# EAGLE design Board v1 (EAGLE 9.1.0)
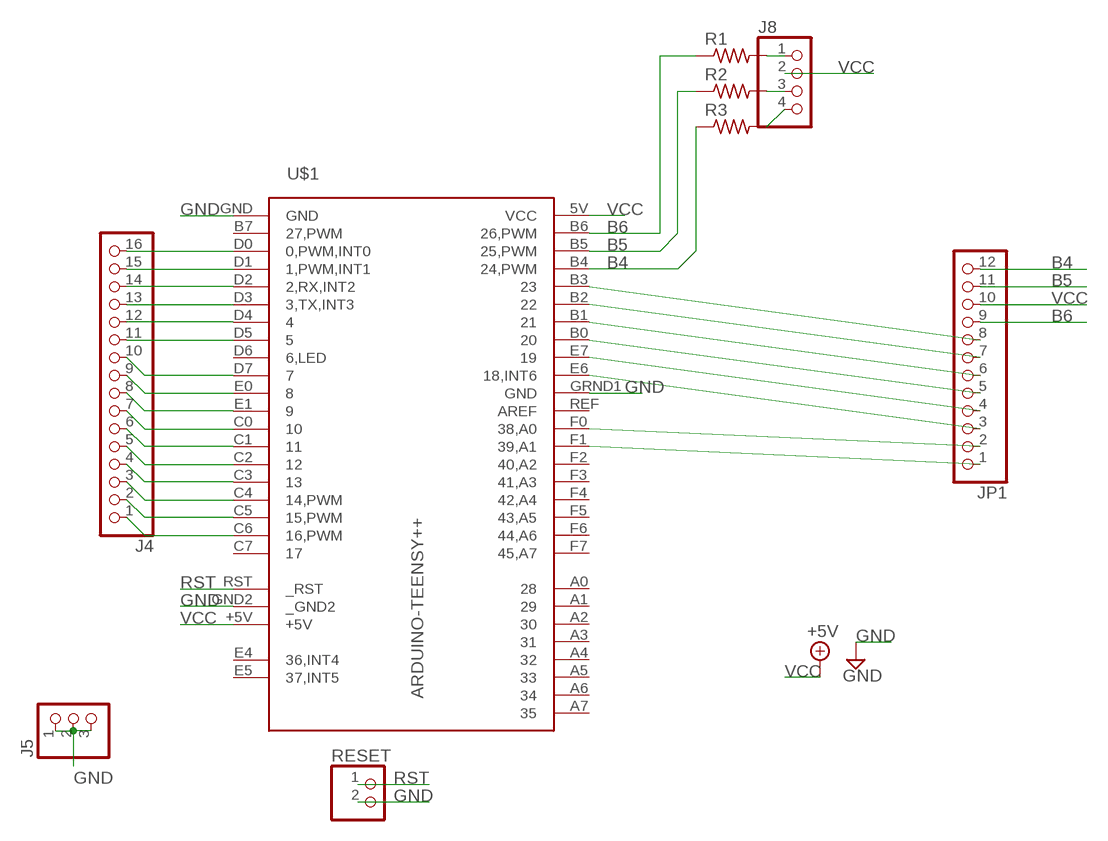
[diagram p0: schematic, sheet 1]

## Parts
J4  PINHD-1X16  [1X16]
J5  PINHD-1X3  [1X03]
J8  PINHD-1X4  [1X04]
JP1  PINHD-1X12  [1X12]
R1  R-US_R0805  [R0805]
R2  R-US_R0805  [R0805]
R3  R-US_R0805  [R0805]
RESET  PINHD-1X2  [1X02]
U$1  ARDUINO-TEENSY++  [TEENSY++]

## Nets
B4: JP1.12 R3.1 U$1.B4(24,PWM)
B5: JP1.11 R2.1 U$1.B5(25,PWM)
B6: JP1.9 R1.1 U$1.B6(26,PWM)
GND: J5.1 J5.2 J5.3 RESET.2 U$1.GND U$1.GND2(_GND2) U$1.GRND1(GND)
N$1: J4.16 U$1.D0(0,PWM,INT0)
N$2: J8.1 R1.2
N$3: J8.3 R2.2
N$4: J8.4 R3.2
N$5: J4.15 U$1.D1(1,PWM,INT1)
N$6: J4.14 U$1.D2(2,RX,INT2)
N$7: J4.13 U$1.D3(3,TX,INT3)
N$8: J4.12 U$1.D4
N$9: J4.11 U$1.D5
N$10: J4.10 U$1.D7
N$11: J4.9 U$1.E0
N$12: J4.8 U$1.E1
N$13: J4.7 U$1.C0
N$14: J4.6 U$1.C1
N$15: J4.5 U$1.C2
N$16: J4.4 U$1.C3
N$17: J4.3 U$1.C4(14,PWM)
N$18: J4.2 U$1.C5(15,PWM)
N$19: J4.1 U$1.C6(16,PWM)
N$23: JP1.8 U$1.B3
N$24: JP1.7 U$1.B2
N$25: JP1.6 U$1.B1
N$26: JP1.5 U$1.B0
N$27: JP1.4 U$1.E7
N$28: JP1.3 U$1.E6(18,INT6)
N$29: JP1.2 U$1.F0(38,A0)
N$30: JP1.1 U$1.F1(39,A1)
RST: RESET.1 U$1.RST(_RST)
VCC: J8.2 JP1.10 U$1.5V(VCC) U$1.+5V ; supply symbol labelled +5V
Unconnected: U$1.A0 U$1.A1 U$1.A2 U$1.A3 U$1.A4 U$1.A5 U$1.A6 U$1.A7 U$1.B7(27,PWM) U$1.C7 U$1.D6(6,LED) U$1.E4(36,INT4) U$1.E5(37,INT5) U$1.F2(40,A2) U$1.F3(41,A3) U$1.F4(42,A4) U$1.F5(43,A5) U$1.F6(44,A6) U$1.F7(45,A7) U$1.REF(AREF)

## Library data of the parts
J4 = pinhead:PINHD-1X16: PIN HEADER
J5 = pinhead:PINHD-1X3: PIN HEADER
J8 = pinhead:PINHD-1X4: PIN HEADER
JP1 = pinhead:PINHD-1X12: PIN HEADER
R1-R3 = resistor:R-US_: RESISTOR, American symbol
RESET = pinhead:PINHD-1X2: PIN HEADER
U$1 = teensypp:ARDUINO-TEENSY++

## Board
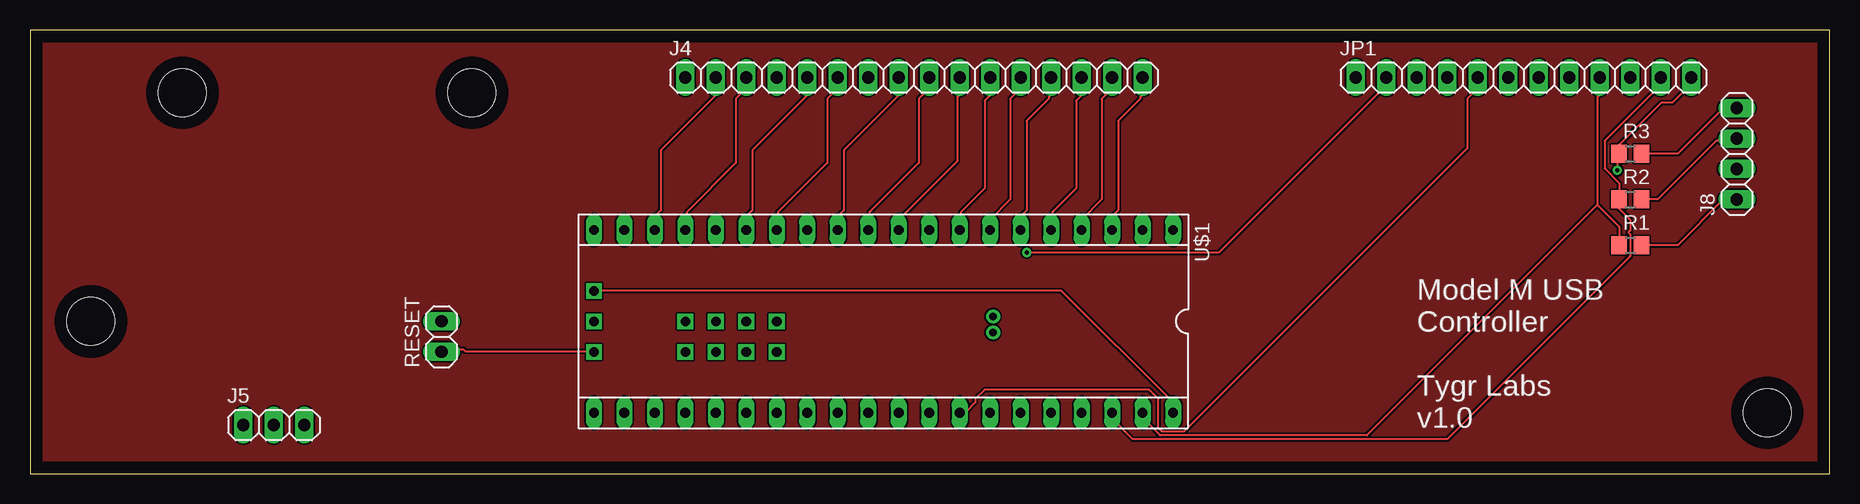
[diagram p1: board, top side]
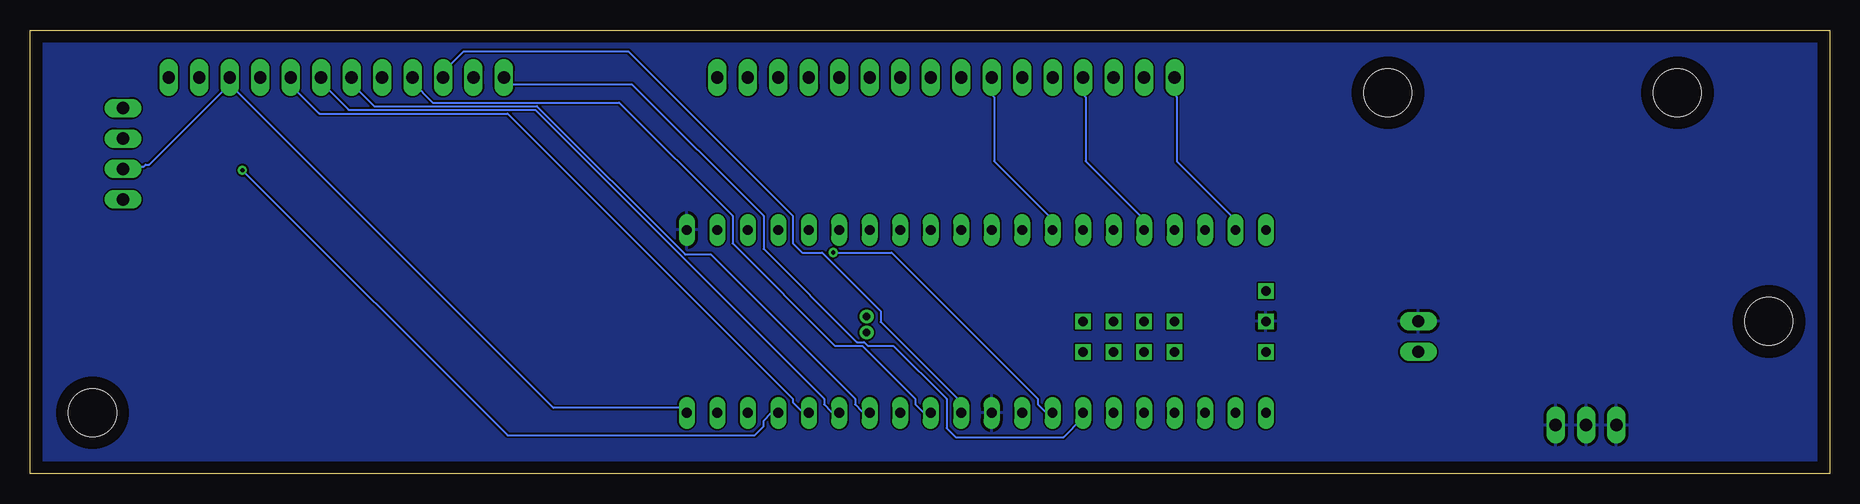
[diagram p2: board, bottom side, seen from below]

Size 149.99 x 36.98 mm. Coordinates in mm from the lower left corner, seen from the top.
Outline: 0,0 149.99,0 149.99,36.98 0,36.98 0,0
Copper layers (1*16): Top 0.035mm / dielectric 1.5mm / Bottom 0.035mm
Design rules "default": minimum track width 6mil, minimum drill 0.35mm, track to track 6mil, track to pad 6mil, pad to pad 6mil, via to via 6mil, smd to smd 6mil, copper to edge 40mil, drill to drill 6mil, minimum pad ring 10mil, minimum via ring 8mil, stop-mask expansion 4mil, vias tented up to drill 0mil, thermal gap 10mil
Holes 3.99 mm at 5.08,12.7 12.7,31.75 36.83,31.75 144.78,5.08

### Footprints (pad centres in the part's own frame; a part is rotated, then mirrored left to right if it is on the bottom)
1X16 = drill 1.016 long: 1 -19.05,0; 2 -16.51,0; 3 -13.97,0; 4 -11.43,0; 5 -8.89,0; 6 -6.35,0; 7 -3.81,0; 8 -1.27,0; 9 1.27,0; 10 3.81,0; 11 6.35,0; 12 8.89,0; 13 11.43,0; 14 13.97,0; 15 16.51,0; 16 19.05,0
1X03 = drill 1.016 long: 1 -2.54,0; 2 0,0; 3 2.54,0
1X04 = drill 1.016 long: 1 -3.81,0; 2 -1.27,0; 3 1.27,0; 4 3.81,0
1X12 = drill 1.016 long: 1 -13.97,0; 2 -11.43,0; 3 -8.89,0; 4 -6.35,0; 5 -3.81,0; 6 -1.27,0; 7 1.27,0; 8 3.81,0; 9 6.35,0; 10 8.89,0; 11 11.43,0; 12 13.97,0
R0805 = smd 1.3 x 1.5: 1 -0.95,0; 2 0.95,0
1X02 = drill 1.016 long: 1 -1.27,0; 2 1.27,0
TEENSY++ = drill 0.8 square: 5V 24.13,-2.54; A0 8.89,0; A1 11.43,0; A2 13.97,0; A3 16.51,0; A4 8.89,2.54; A5 11.43,2.54; A6 13.97,2.54; A7 16.51,2.54; GND2 24.13,0; RST 24.13,2.54 | drill 0.813 long: +5V -24.13,7.62; B0 -6.35,7.62; B1 -8.89,7.62; B2 -11.43,7.62; B3 -13.97,7.62; B4 -16.51,7.62; B5 -19.05,7.62; B6 -21.59,7.62; B7 -21.59,-7.62; C0 6.35,-7.62; C1 8.89,-7.62; C2 11.43,-7.62; C3 13.97,-7.62; C4 16.51,-7.62; C5 19.05,-7.62; C6 21.59,-7.62; C7 24.13,-7.62; D0 -19.05,-7.62; D1 -16.51,-7.62; D2 -13.97,-7.62; D3 -11.43,-7.62; D4 -8.89,-7.62; D5 -6.35,-7.62; D6 -3.81,-7.62; D7 -1.27,-7.62; E0 1.27,-7.62; E1 3.81,-7.62; E6 -1.27,7.62; E7 -3.81,7.62; F0 6.35,7.62; F1 8.89,7.62; F2 11.43,7.62; F3 13.97,7.62; F4 16.51,7.62; F5 19.05,7.62; F6 21.59,7.62; F7 24.13,7.62; GND -24.13,-7.62; GRND1 1.27,7.62; REF 3.81,7.62 | drill 0.635 pad 1.067: E4 -9.144,0.914; E5 -9.144,-0.406

### Placement (x,y rotation side)
J4  73.66,33.02 0 top
J5  20.32,4.06 0 top
J8  142.24,26.67 90 top
JP1  124.46,33.02 0 top
R1  133.35,19.05 0 top
R2  133.35,22.86 0 top
R3  133.35,26.67 0 top
RESET  34.29,11.43 90 top
U$1  71.12,12.7 180 top

### Tracks (layer width: path | path; a pad name or v marks a point on that pad's centre or on a via)
B4  (via drill 0.35)
  Top 0.152: JP1.12 138.38,32.92 138.38,32.46 136.85,30.94 135.94,30.94 132.44,27.43 132.44,26.67 R3.1 132.28,26.67 v132.28,25.3
  Bottom 0.152: v132.28,25.3 110.19,3.2 89.61,3.2 88.85,3.96 88.85,4.42 88.24,5.03 87.63,5.03 U$1.B4
B5
  Top 0.152: 132.44,22.86 132.44,24.23 131.22,25.45 131.22,27.74 135.79,32.31 135.79,32.92 JP1.11 | 132.44,22.86 R2.1 132.44,22.86 | 132.44,22.86 132.44,22.1 133.35,21.18 133.35,20.27 133.2,20.12 133.35,19.96 133.35,18.14 118.11,2.9 91.9,2.9 90.22,4.57 90.22,5.03 U$1.B5
B6
  Top 0.152: 130.61,22.4 132.44,20.57 132.44,19.05 R1.1 | 130.61,22.4 130.61,31.39 130.76,31.55 130.76,32.92 JP1.9 | 130.61,22.4 111.4,3.2 94.18,3.2 92.81,4.57 92.81,5.03 U$1.B6
GND
  pour Bottom: 0,0 0,36.83 149.86,36.83 149.86,0
N$1
  Top 0.152: U$1.D0 90.22,20.42 90.22,21.49 90.68,21.95 90.68,29.41 92.51,31.24 92.51,31.39 92.66,31.55 92.66,32.92 J4.16
N$2
  Top 0.152: R1.2 134.42,19.05 137.31,19.05 141.12,22.86 142.19,22.86 J8.1
N$3
  Top 0.152: R2.2 134.42,22.86 135.64,22.86 140.51,27.74 140.66,27.74 140.82,27.89 142.19,27.89 J8.3
N$4
  Top 0.152: R3.2 134.42,26.67 137.31,26.67 141.12,30.48 142.19,30.48 J8.4
N$5
  Top 0.152: U$1.D1 87.63,20.42 87.63,21.18 89.31,22.86 89.31,31.24 90.07,32 90.07,32.92 J4.15
N$6
  Top 0.152: U$1.D2 85.19,20.42 85.19,21.79 87.17,23.77 87.17,31.09 87.63,31.55 87.63,32.92 J4.14
N$7
  Top 0.152: U$1.D3 82.6,20.42 82.6,21.49 83.06,21.95 83.06,29.41 84.89,31.24 84.89,31.39 85.04,31.55 85.04,32.92 J4.13
N$8
  Top 0.152: U$1.D4 80.01,20.42 80.01,21.18 81.69,22.86 81.69,31.24 82.45,32 82.45,32.92 J4.12
N$9
  Top 0.152: U$1.D5 77.57,20.42 77.57,21.79 79.55,23.77 79.55,31.09 80.01,31.55 80.01,32.92 J4.11
N$10
  Top 0.152: U$1.D7 72.39,20.42 72.39,21.18 77.27,26.06 77.27,31.39 77.42,31.55 77.42,32.92 J4.10
N$11
  Top 0.152: U$1.E0 69.95,20.42 69.95,21.79 74.07,25.91 74.07,31.24 74.83,32 74.83,32.92 J4.9
N$12
  Top 0.152: U$1.E1 67.36,20.42 67.36,21.49 67.82,21.95 67.82,26.98 72.39,31.55 72.39,32.92 J4.8
N$13
  Bottom 0.152: U$1.C0 64.77,20.42 64.77,21.18 69.65,26.06 69.65,31.39 69.8,31.55 69.8,32.92 J4.7
N$14
  Top 0.152: U$1.C1 62.33,20.42 62.33,21.79 66.45,25.91 66.45,31.24 67.21,32 67.21,32.92 J4.6
N$15
  Top 0.152: U$1.C2 59.74,20.42 59.74,21.49 60.2,21.95 60.2,26.98 64.77,31.55 64.77,32.92 J4.5
N$16
  Bottom 0.152: U$1.C3 57.15,20.42 57.15,21.18 62.03,26.06 62.03,31.39 62.18,31.55 62.18,32.92 J4.4
N$17
  Top 0.152: U$1.C4 54.71,20.42 54.71,21.79 58.83,25.91 58.83,31.24 59.59,32 59.59,32.92 J4.3
N$18
  Top 0.152: U$1.C5 52.12,20.42 52.12,21.49 52.58,21.95 52.58,26.98 57.15,31.55 57.15,32.92 J4.2
N$19
  Bottom 0.152: U$1.C6 49.53,20.42 49.53,21.18 54.41,26.06 54.41,31.39 54.56,31.55 54.56,32.92 J4.1
N$23
  Bottom 0.152: U$1.B3 85.19,5.18 85.65,5.18 86.41,5.94 86.41,6.25 110.19,30.02 125.88,30.02 128.17,32.31 128.17,32.92 JP1.8
N$24
  Bottom 0.152: U$1.B2 82.6,5.18 83.21,5.18 83.82,5.79 83.82,6.25 107.9,30.33 123.44,30.33 125.73,32.61 125.73,32.92 JP1.7
N$25
  Bottom 0.152: U$1.B1 80.01,5.18 80.62,5.18 81.23,5.79 81.23,6.25 93.27,18.29 95.4,18.29 107.75,30.63 121.31,30.63 123.14,32.46 123.14,32.92 JP1.6
N$26
  Top 0.152: U$1.B0 77.57,5.18 78.03,5.18 78.79,5.94 78.79,6.25 79.55,7.01 93.27,7.01 94.03,6.25 94.03,3.81 94.34,3.5 96.16,3.5 119.79,27.13 119.79,31.24 120.55,32 120.55,32.92 JP1.5
N$27
  Bottom 0.152: U$1.E7 74.98,5.18 75.59,5.18 76.2,5.79 76.2,6.25 80.62,10.67 82.91,10.67 91.44,19.2 91.44,21.49 100.89,30.94 116.43,30.94 118.11,32.61 118.11,32.92 JP1.4
N$28
  Bottom 0.152: U$1.E6 72.39,5.18 72.39,5.94 79.1,12.65 79.1,13.56 83.97,18.44 85.65,18.44 86.41,19.2 86.41,21.49 100.13,35.2 113.84,35.2 115.52,33.53 115.52,33.07 JP1.3
N$29  (via drill 0.35)
  Top 0.152: v83.06,18.44 99.06,18.44 112.93,32.31 112.93,32.92 JP1.2
  Bottom 0.152: v83.06,18.44 78.18,18.44 65.99,6.25 65.99,5.79 65.38,5.18 64.77,5.18 U$1.F0
N$30
  Bottom 0.152: U$1.F1 62.33,5.03 62.33,4.57 63.86,3.05 72.85,3.05 73.61,3.81 73.61,6.25 78.03,10.67 80.16,10.67 80.47,10.97 81.08,10.97 88.85,18.75 88.85,21.49 99.82,32.46 110.03,32.46 110.49,32.92 JP1.1
N$32
  pour Top: 0,0 0,36.83 149.86,36.83 149.86,0
RST
  Top 0.152: U$1.RST 46.94,10.21 36.27,10.21 36.12,10.36 34.44,10.36 34.29,10.21 RESET.1
VCC
  Top 0.152: U$1.5V 47.09,15.24 85.95,15.24 95.25,5.94 95.25,5.18 U$1.+5V
  Bottom 0.152: 133.35,32.46 133.35,32.92 JP1.10 133.35,32.46 | 133.35,32.46 140.06,25.76 140.36,25.76 140.51,25.6 140.66,25.6 140.82,25.45 142.19,25.45 J8.2 | 133.35,32.46 106.38,5.49 95.56,5.49 95.25,5.18 U$1.+5V

### Text on the board
tPlace: Model M USB / Controller / / Tygr Labs / v1.0